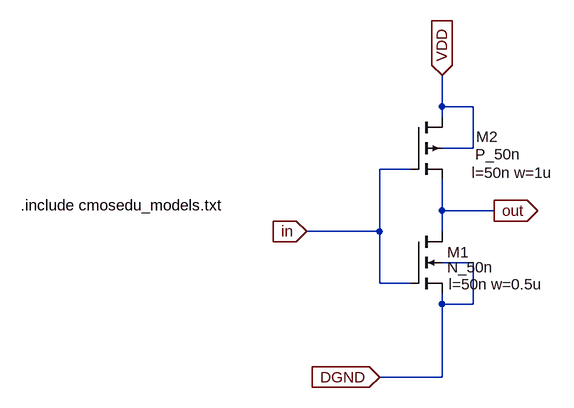
[diagram p0: schematic inverter.asc]
inverter.asc, the LTspice schematic file:
Version 4
SHEET 1 880 680
WIRE 176 -32 176 -80
WIRE 224 -32 176 -32
WIRE 176 -16 176 -32
WIRE 224 32 224 -32
WIRE 224 32 176 32
WIRE 128 64 80 64
WIRE 176 128 176 80
WIRE 256 128 176 128
WIRE 80 160 80 64
WIRE 80 160 -32 160
WIRE 176 160 176 128
WIRE 224 208 176 208
WIRE 80 240 80 160
WIRE 128 240 80 240
WIRE 176 272 176 256
WIRE 224 272 224 208
WIRE 224 272 176 272
WIRE 176 384 176 272
WIRE 176 384 80 384
FLAG 176 -80 VDD
IOPIN 176 -80 In
FLAG -32 160 in
IOPIN -32 160 In
FLAG 256 128 out
IOPIN 256 128 Out
FLAG 80 384 DGND
IOPIN 80 384 In
SYMBOL nmos4 128 160 R0
WINDOW 3 56 55 Left 2
WINDOW 123 58 81 Left 2
SYMATTR Value N_50n
SYMATTR Value2 l=50n w=0.5u
SYMATTR InstName M1
SYMBOL pmos4 128 -16 R0
WINDOW 0 101 30 Left 2
WINDOW 3 99 57 Left 2
WINDOW 123 94 86 Left 2
SYMATTR InstName M2
SYMATTR Value P_50n
SYMATTR Value2 l=50n w=1u
TEXT -472 120 Left 2 !.include cmosedu_models.txt

The netlist it stands for:
* inverter.asc
M1 out in DGND DGND N_50n l=50n w=0.5u
M2 VDD in out VDD P_50n l=50n w=1u
.model NMOS NMOS
.model PMOS PMOS
.lib standard.mos
.include cmosedu_models.txt
.backanno
.end